# EAGLE schematic Routing_option1d (EAGLE 9.6.2)
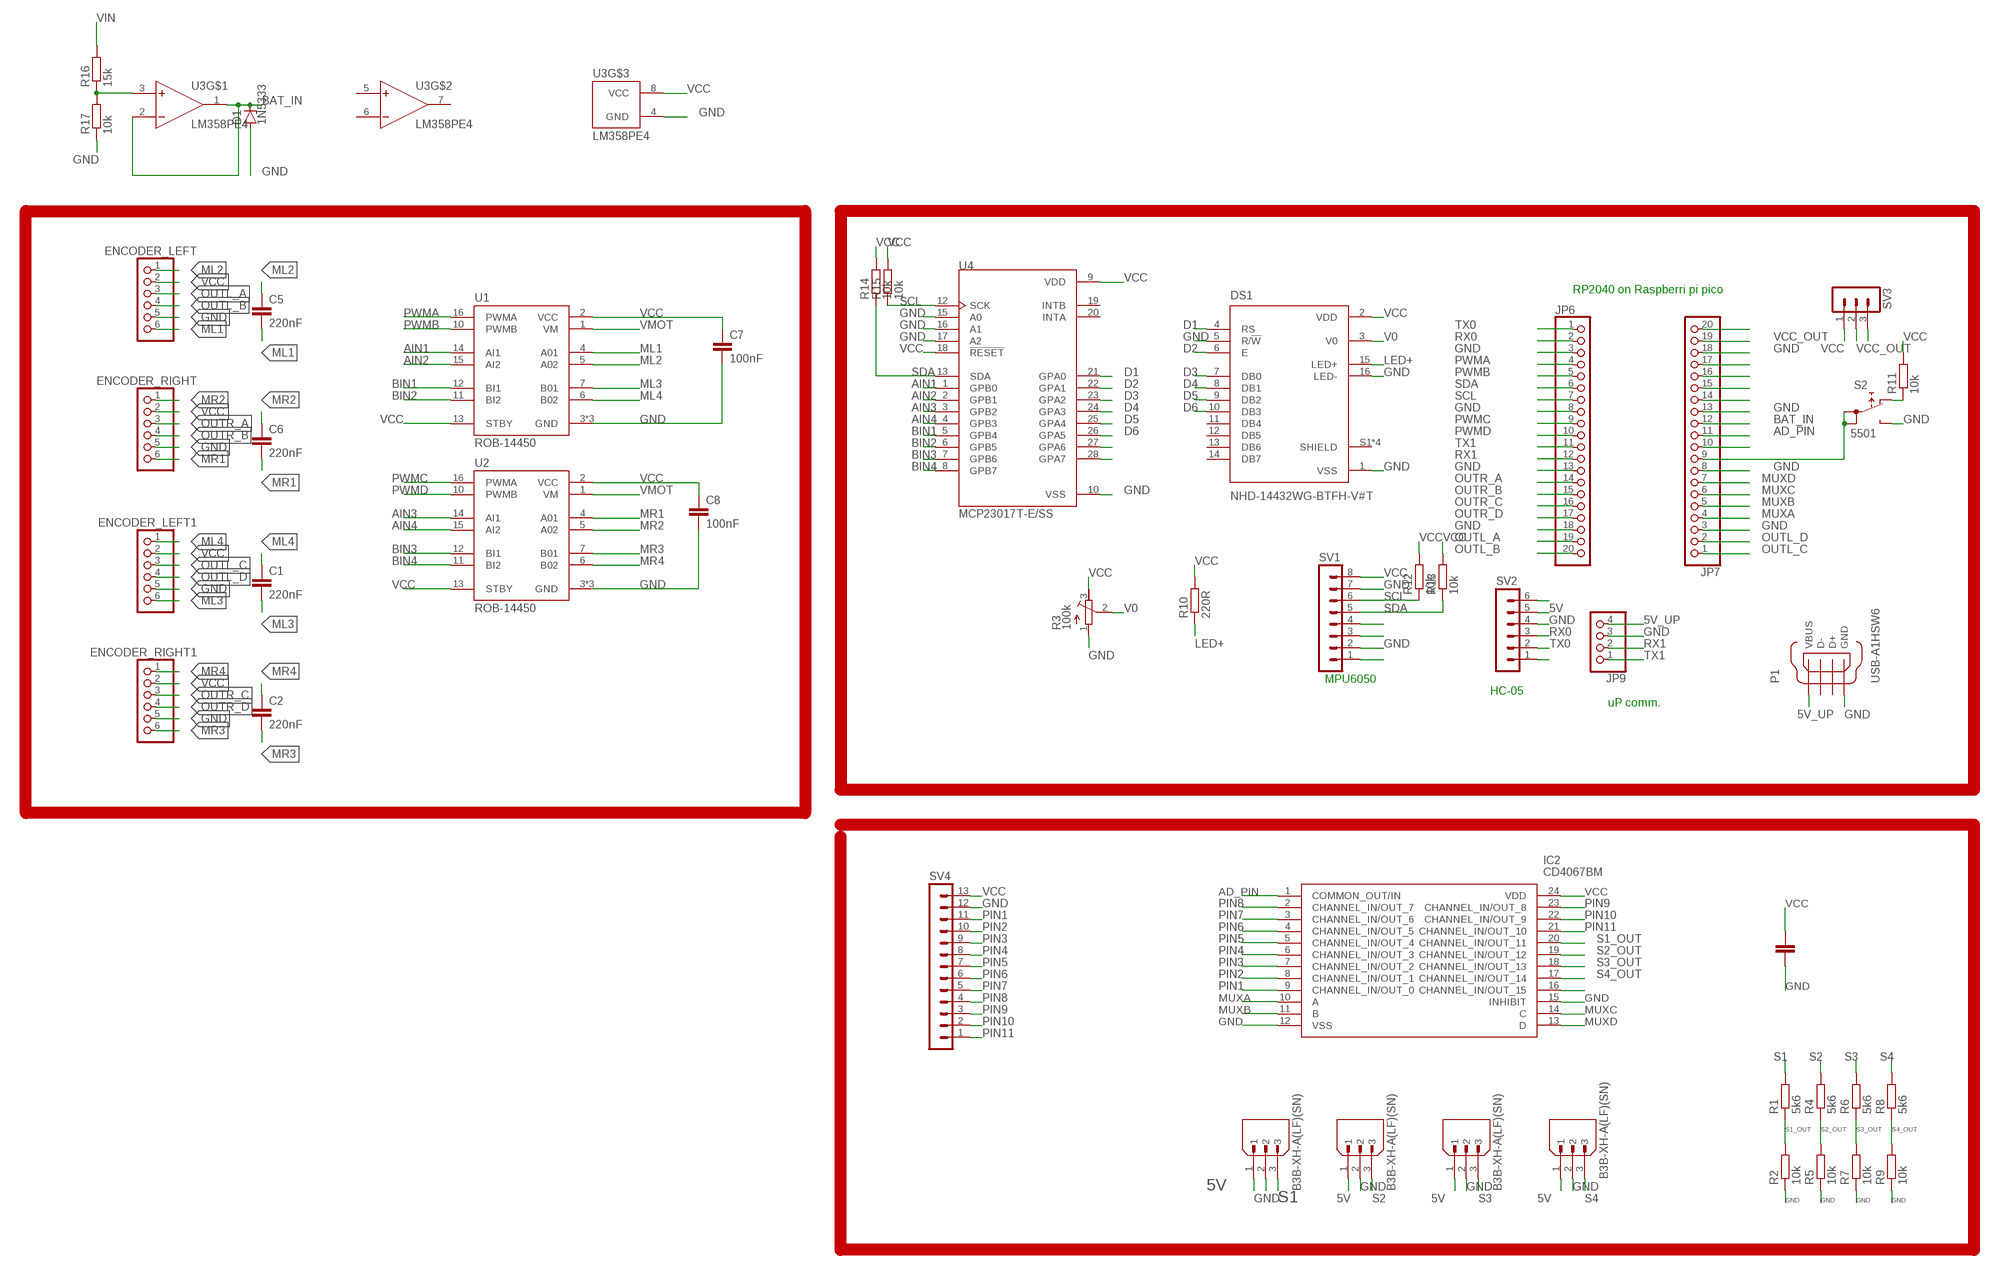
[diagram p0: schematic, sheet 1, part 1 of 2]
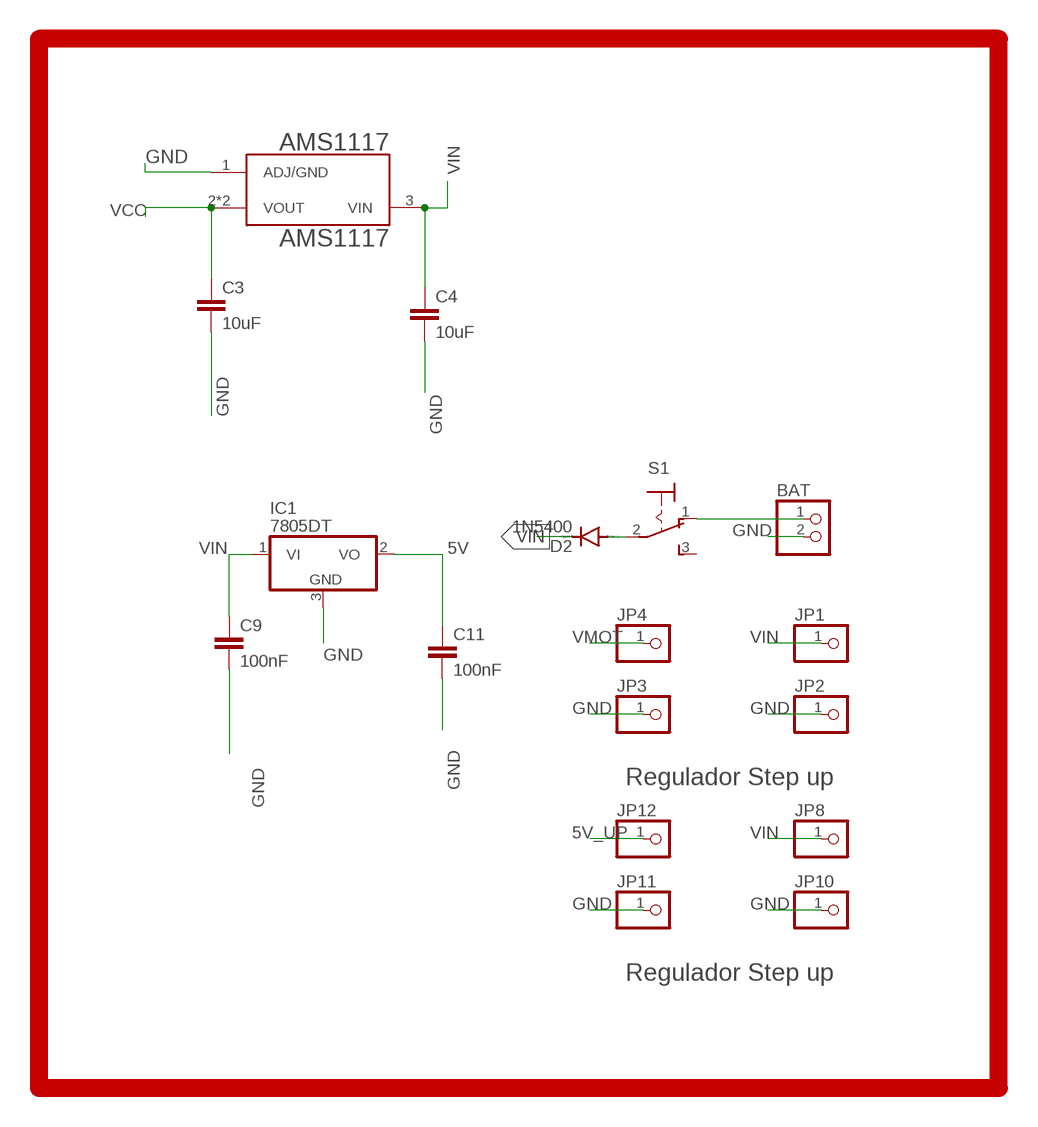
[diagram p1: schematic, sheet 1, part 2 of 2]

## Parts
AMS1117  AMS1117  [SOT229P700X180-4N]
BAT  PINHD-1X2  [1X02]
C1  220nF  C-EUC0805  [C0805]
C2  220nF  C-EUC0805  [C0805]
C3  10uF  C-EUC0805  [C0805]
C4  10uF  C-EUC0805  [C0805]
C5  220nF  C-EUC0805  [C0805]
C6  220nF  C-EUC0805  [C0805]
C7  100nF  C-EUC0805  [C0805]
C8  100nF  C-EUC0805  [C0805]
C9  100nF  C-EUC0805  [C0805]
C10  100nF  C-EUC0805  [C0805]
C11  100nF  C-EUC0805  [C0805]
D1  1N5333  [C1702-15]
D2  1N5400  [DO201-15]
DIR  B3B-XH-A(LF)(SN)  [JST_B3B-XH-A(LF)(SN)]
DS1  NHD-14432WG-BTFH-V#T  [LCD_NHD-14432WG-BTFH-V#T]
ENCODER_LEFT  PINHD-1X6  [1X06]
ENCODER_LEFT1  PINHD-1X6  [1X06]
ENCODER_RIGHT  PINHD-1X6  [1X06]
ENCODER_RIGHT1  PINHD-1X6  [1X06]
ESQ  B3B-XH-A(LF)(SN)  [JST_B3B-XH-A(LF)(SN)]
FRENT  B3B-XH-A(LF)(SN)  [JST_B3B-XH-A(LF)(SN)]
IC1  7805DT  [TO252]
IC2  CD4067BM  [SOIC127P1030X265-24N]
JP1  PINHD-1X1  [1X01]
JP2  PINHD-1X1  [1X01]
JP3  PINHD-1X1  [1X01]
JP4  PINHD-1X1  [1X01]
JP6  PINHD-1X20  [1X20]
JP7  PINHD-1X20  [1X20]
JP8  PINHD-1X1  [1X01]
JP9  PINHD-1X4  [1X04]
JP10  PINHD-1X1  [1X01]
JP11  PINHD-1X1  [1X01]
JP12  PINHD-1X1  [1X01]
P1  USB-A1HSW6  [OST_USB-A1HSW6]
R1  5k6  R-EU_R0805  [R0805]
R2  10k  R-EU_R0805  [R0805]
R3  100k  R-TRIMM64W  [RTRIM64W]
R4  5k6  R-EU_R0805  [R0805]
R5  10k  R-EU_R0805  [R0805]
R6  5k6  R-EU_R0805  [R0805]
R7  10k  R-EU_R0805  [R0805]
R8  5k6  R-EU_R0805  [R0805]
R9  10k  R-EU_R0805  [R0805]
R10  220R  R-EU_R0805  [R0805]
R11  10k  R-EU_R0805  [R0805]
R12  10k  R-EU_R0805  [R0805]
R13  10k  R-EU_R0805  [R0805]
R14  10k  R-EU_R0805  [R0805]
R15  10k  R-EU_R0805  [R0805]
R16  15k  R-EU_R0805  [R0805]
R17  10k  R-EU_R0805  [R0805]
S1  320-916  [320-916]
S2  5501  [5501]
SV1  MA08-1  [MA08-1]
SV2  MA06-1  [MA06-1]
SV3  MA03-1  [MA03-1]
SV4  MA13-1  [MA13-1]
TRAS  B3B-XH-A(LF)(SN)  [JST_B3B-XH-A(LF)(SN)]
U1  ROB-14450  [MODULE_ROB-14450]
U2  ROB-14450  [MODULE_ROB-14450]
U3  LM358PE4  [DIP794W45P254L959H508Q8]
U4  MCP23017T-E/SS  [SOP65P780X200-28N]

## Nets
5V: C11.1 DIR.1 ESQ.1 FRENT.1 IC1.2(VO) SV2.5 TRAS.1
5V_UP: JP9.4 JP12.1 P1.1(VBUS)
AD2: JP7.14
AD_PIN: IC2.1(COMMON_OUT/IN) JP7.11
AIN1: U1.14(AI1) U4.1(GPB0)
AIN2: U1.15(AI2) U4.2(GPB1)
AIN3: U2.14(AI1) U4.3(GPB2)
AIN4: U2.15(AI2) U4.4(GPB3)
BAT_IN: D1.C JP7.12 U3.1(OUT1) U3.2(-IN1)
BIN1: U1.12(BI1) U4.5(GPB4)
BIN2: U1.11(BI2) U4.6(GPB5)
BIN3: U2.12(BI1) U4.7(GPB6)
BIN4: U2.11(BI2) U4.8(GPB7)
D1: DS1.4(RS) U4.21(GPA0)
D2: DS1.6(E) U4.22(GPA1)
D3: DS1.7(DB0) U4.23(GPA2)
D4: DS1.8(DB1) U4.24(GPA3)
D5: DS1.9(DB2) U4.25(GPA4)
D6: DS1.10(DB3) U4.26(GPA5)
GND: AMS1117.1(ADJ/GND) BAT.2 C3.2 C4.2 C7.2 C8.2 C9.2 C10.2 C11.2 D1.A DIR.2 DS1.1(VSS) DS1.5(R/!W) DS1.16(LED-) ENCODER_LEFT1.5 ENCODER_LEFT.5 ENCODER_RIGHT1.5 ENCODER_RIGHT.5 ESQ.2 FRENT.2 IC1.3(GND) IC2.12(VSS) IC2.15(INHIBIT) JP2.1 JP3.1 JP6.3 JP6.8 JP6.13 JP6.18 JP7.3 JP7.8 JP7.13 JP7.18 JP9.3 JP10.1 JP11.1 P1.4(GND) R2.1 R3.1(A) R5.1 R7.1 R9.1 R17.1 S2.NO SV1.2 SV1.7 SV2.4 SV4.12 TRAS.2 U1.3(GND) U1.8(GND) U1.9(GND) U2.3(GND) U2.8(GND) U2.9(GND) U3.4(GND) U4.10(VSS) U4.15(A0) U4.16(A1) U4.17(A2)
LED+: DS1.15(LED+) R10.1
ML1: C5.2 ENCODER_LEFT.6 U1.4(A01)
ML2: C5.1 ENCODER_LEFT.1 U1.5(A02)
ML3: C1.2 ENCODER_LEFT1.6 U1.7(B01)
ML4: C1.1 ENCODER_LEFT1.1 U1.6(B02)
MR1: C6.2 ENCODER_RIGHT.6 U2.4(A01)
MR2: C6.1 ENCODER_RIGHT.1 U2.5(A02)
MR3: C2.2 ENCODER_RIGHT1.6 U2.7(B01)
MR4: C2.1 ENCODER_RIGHT1.1 U2.6(B02)
MUXA: IC2.10(A) JP7.4
MUXB: IC2.11(B) JP7.5
MUXC: IC2.14(C) JP7.6
MUXD: IC2.13(D) JP7.7
N$2: D2.A S1.2(P)
N$3: BAT.1 S1.1(O)
N$4: R11.1 S2.NC
N$5: SV3.3
N$6: R16.1 R17.2 U3.3(+IN1)
N$13: SV1.4
N$14: SV1.3
N$16: SV1.1
N$17: SV2.6
N$26: SV2.1
N$47: U4.27(GPA6)
N$48: U4.28(GPA7)
NET$4: JP7.20
NET$5: JP7.17
NET$6: JP7.16
NET$7: JP7.15
NET$8: JP7.10
NET$15: JP7.9 S2.1A S2.1B
OUTL_A: ENCODER_LEFT.3 JP6.19
OUTL_B: ENCODER_LEFT.4 JP6.20
OUTL_C: ENCODER_LEFT1.3 JP7.1
OUTL_D: ENCODER_LEFT1.4 JP7.2
OUTR_A: ENCODER_RIGHT.3 JP6.14
OUTR_B: ENCODER_RIGHT.4 JP6.15
OUTR_C: ENCODER_RIGHT1.3 JP6.16
OUTR_D: ENCODER_RIGHT1.4 JP6.17
PIN1: IC2.9(CHANNEL_IN/OUT_0) SV4.11
PIN2: IC2.8(CHANNEL_IN/OUT_1) SV4.10
PIN3: IC2.7(CHANNEL_IN/OUT_2) SV4.9
PIN4: IC2.6(CHANNEL_IN/OUT_3) SV4.8
PIN5: IC2.5(CHANNEL_IN/OUT_4) SV4.7
PIN6: IC2.4(CHANNEL_IN/OUT_5) SV4.6
PIN7: IC2.3(CHANNEL_IN/OUT_6) SV4.5
PIN8: IC2.2(CHANNEL_IN/OUT_7) SV4.4
PIN9: IC2.23(CHANNEL_IN/OUT_8) SV4.3
PIN10: IC2.22(CHANNEL_IN/OUT_9) SV4.2
PIN11: IC2.21(CHANNEL_IN/OUT_10) SV4.1
PWMA: JP6.4 U1.16(PWMA)
PWMB: JP6.5 U1.10(PWMB)
PWMC: JP6.9 U2.16(PWMA)
PWMD: JP6.10 U2.10(PWMB)
RX0: JP6.2 SV2.3
RX1: JP6.12 JP9.2
S1: FRENT.3 R1.2
S1_OUT: IC2.20(CHANNEL_IN/OUT_11) R1.1 R2.2
S2: ESQ.3 R4.2
S2_OUT: IC2.19(CHANNEL_IN/OUT_12) R4.1 R5.2
S3: DIR.3 R6.2
S3_OUT: IC2.18(CHANNEL_IN/OUT_13) R6.1 R7.2
S4: R8.2 TRAS.3
S4_OUT: IC2.17(CHANNEL_IN/OUT_14) R8.1 R9.2
S5: IC2.16(CHANNEL_IN/OUT_15)
SCL: JP6.7 R12.1 R15.1 SV1.6 U4.12(SCK)
SDA: JP6.6 R13.1 R14.1 SV1.5 U4.13(SDA)
TX0: JP6.1 SV2.2
TX1: JP6.11 JP9.1
V0: DS1.3(V0) R3.2(S)
VCC: AMS1117.2(VOUT) AMS1117.4(VOUT) C3.1 C7.1 C8.1 C10.1 DS1.2(VDD) ENCODER_LEFT1.2 ENCODER_LEFT.2 ENCODER_RIGHT1.2 ENCODER_RIGHT.2 IC2.24(VDD) R3.3(E) R10.2 R11.2 R12.2 R13.2 R14.2 R15.2 SV1.8 SV3.1 SV4.13 U1.2(VCC) U1.13(STBY) U2.2(VCC) U2.13(STBY) U3.8(VCC) U4.9(VDD) U4.18(!RESET)
VCC_OUT: JP7.19 SV3.2
VIN: AMS1117.3(VIN) C4.1 C9.1 D2.C IC1.1(VI) JP1.1 JP8.1 R16.2
VMOT: JP4.1 U1.1(VM) U2.1(VM)
Unconnected: DS1.11(DB4) DS1.12(DB5) DS1.13(DB6) DS1.14(DB7) DS1.S1(SHIELD) DS1.S2(SHIELD) DS1.S3(SHIELD) DS1.S4(SHIELD) P1.2(D-) P1.3(D+) S1.3(S) U3.5(+IN2) U3.6(-IN2) U3.7(OUT2) U4.19(INTB) U4.20(INTA)

## Notes on the sheet
- RP2040 on Raspberri pi pico
- MPU6050
- HC-05
- uP comm. | Regulador Step up
- Regulador Step up

## Library data of the parts
AMS1117 = AMS1117_REGULADOR:AMS1117: Sot223/Pkg 1-Amp 5-Volt Low Drop Out Voltage Regulatator Check prices <https://pricing.snapeda.com/parts/AMS1117/Advanced%20Monolithic%20Systems/view-part?ref=eda>; AVAILABILITY: In Stock; DESCRIPTION: 1A LOW DROPOUT VOLTAGE REGULATOR SOT-223; MF: Advanced Monolithic Systems; MP: AMS1117; PACKAGE: SOT-223 Seeed Technology; PRICE: None
BAT = pinhead:PINHD-1X2: PIN HEADER
C1-C11 = rcl:C-EU: CAPACITOR, European symbol; SPICEPREFIX: C
D1 = diode:1N5333: Z DIODE 3.3 V, 5W, 5 percent (Motorola)
D2 = diode:1N5400: DIODE standard rectifier, 3 A, 50 V (Motorola)
DIR ESQ FRENT TRAS = B3B-XH-A_LF__SN_:B3B-XH-A(LF)(SN): Check availability <https://pricing.snapeda.com/parts/B3B-XH-A%28LF%29%28SN%29/JST%20Sales/view-part?ref=eda>; AVAILABILITY: In Stock; DESCRIPTION: Connector Header Through Hole 3 position 0.098 (2.50mm); MF: JST Sales; MP: B3B-XH-A(LF)(SN); PACKAGE: None; PRICE: None; PURCHASE-URL: https://pricing.snapeda.com/search/part/B3B-XH-A(LF)(SN)/?ref=eda
DS1 = NHD-14432WG-BTFH-V_T:NHD-14432WG-BTFH-V#T: LCD Graphic Display; 144x32 Pixels; 80x36; FSTN (+); Transflective; 8-Bit Parallel Check availability <https://pricing.snapeda.com/parts/NHD-14432WG-BTFH-V%23T/Newhaven%20Display/view-part?ref=eda>; AVAILABILITY: In Stock; DESCRIPTION: - Graphic LCD Display Module Transflective Black (White - Inverted) FSTN - Film Super-Twisted Nematic Parallel, 8-Bit - 144 x 32; MF: Newhaven Display; MP: NHD-14432WG-BTFH-V#T; PACKAGE: None; PRICE: None; PURCHASE-URL: https://pricing.snapeda.com/search?q=NHD-14432WG-BTFH-V#T&ref=eda
ENCODER_LEFT ENCODER_LEFT1 ENCODER_RIGHT ENCODER_RIGHT1 = pinhead:PINHD-1X6: PIN HEADER
IC1 = linear:78*: Positive VOLTAGE REGULATOR Source: http://cache.national.com/ds/LM/LM78L05.pdf http://www.fairchildsemi.com/ds/LM/LM7805.pdf
IC2 = CD4067BM:CD4067BM: Analog Multiplexer/Demultiplexer SOIC24 Texas Instruments CD4067BM, Multiplexer/Demultiplexer Single 16:1, 3 18 V, 24-Pin SOIC Source: Datasheet <http://www.ti.com/lit/ds/symlink/cd4067b.pdf>; ARROW_PART_NUMBER: CD4067BM; ARROW_PRICE-STOCK: https://www.arrow.com/en/products/cd4067bm/texas-instruments; DESCRIPTION: Analog Multiplexer/Demultiplexer SOIC24 Texas Instruments CD4067BM, Multiplexer/Demultiplexer Single 16:1, 3 18 V, 24-Pin SOIC; HEIGHT: 2.65mm; MANUFACTURER_NAME: Texas Instruments; MANUFACTURER_PART_NUMBER: CD4067BM; MOUSER_PART_NUMBER: 595-CD4067BM; MOUSER_PRICE-STOCK: https://www.mouser.co.uk/ProductDetail/Texas-Instruments/CD4067BM?qs=LSR%252BNeaw%2FwBojsvkXxI5Ew%3D%3D
JP1-JP4 JP8 JP10-JP12 = pinhead:PINHD-1X1: PIN HEADER
JP6 JP7 = pinhead:PINHD-1X20: PIN HEADER
JP9 = pinhead:PINHD-1X4: PIN HEADER
P1 = USB-A1HSW6:USB-A1HSW6: USB - A Receptacle Connector 4 Position Through Hole, Right Angle Check availability <https://pricing.snapeda.com/parts/USB-A1HSW6/On%20Shore/view-part?ref=eda>; AVAILABILITY: In Stock; DESCRIPTION: USB-A (USB TYPE-A) - Receptacle Connector 4 Position Through Hole, Right Angle; MF: On Shore; MP: USB-A1HSW6; PACKAGE: None; PRICE: None; PURCHASE-URL: https://pricing.snapeda.com/search?q=USB-A1HSW6&ref=eda
R1 R2 R4-R17 = rcl:R-EU_: RESISTOR, European symbol; SPICEPREFIX: R
R3 = rcl:R-TRIMM: Trimm resistor; SPICEMODEL: X; SPICEPREFIXL: POT
S1 = switch:320-916: TOGGLE SWITCH distributor RS Components
S2 = switch:55?: PUSHBUTTON SERIES 5500 SWITCHES Source: www.e-switch.com .. 5500.pdf
SV1 = con-lstb:MA08-1: PIN HEADER; OC_FARNELL: unknown; OC_NEWARK: unknown
SV2 = con-lstb:MA06-1: PIN HEADER; OC_FARNELL: unknown; OC_NEWARK: unknown
SV3 = con-lstb:MA03-1: PIN HEADER; OC_FARNELL: unknown; OC_NEWARK: unknown
SV4 = con-lstb:MA13-1: PIN HEADER; OC_FARNELL: unknown; OC_NEWARK: unknown
U1 U2 = ROB-14450:ROB-14450: TB6612FNG Motor Controller/Driver Power Management Evaluation Board Check availability <https://pricing.snapeda.com/parts/ROB-14450/SparkFun%20Electronics/view-part?ref=eda>; AVAILABILITY: In Stock; DESCRIPTION: TB6612FNG Motor Controller/Driver Power Management Evaluation Board; MF: SparkFun Electronics; MP: ROB-14450; PACKAGE: None; PRICE: None; PURCHASE-URL: https://pricing.snapeda.com/search/part/ROB-14450/?ref=eda
U3 = LM358PE4:LM358PE4: Check prices <https://pricing.snapeda.com/parts/LM358PE4/Texas%20Instruments/view-part?ref=eda> Check availability <https://pricing.snapeda.com/parts/LM358PE4/Texas%20Instruments/view-part?ref=eda>; AVAILABILITY: In Stock; DESCRIPTION: Dual, 30-V, 700-kHz operational amplifier; MF: Texas Instruments; MP: LM358PE4; PACKAGE: PDIP-8 Texas; PRICE: None; PURCHASE-URL: https://pricing.snapeda.com/search?q=LM358PE4&ref=eda
U4 = MCP23017T-E_SS:MCP23017T-E/SS: 16-bit Input/Output Expander, I2C interface, Pb-free28 SSOP .209in T/R Check availability <https://pricing.snapeda.com/parts/MCP23017T-E/SS/Microchip/view-part?ref=eda>; AVAILABILITY: In Stock; DESCRIPTION: I/O Expander 16 I²C 1.7 MHz 28-SSOP; MF: Microchip; MP: MCP23017T-E/SS; PACKAGE: SSOP-28 Microchip; PRICE: None; PURCHASE-URL: https://pricing.snapeda.com/search?q=MCP23017T-E/SS&ref=eda